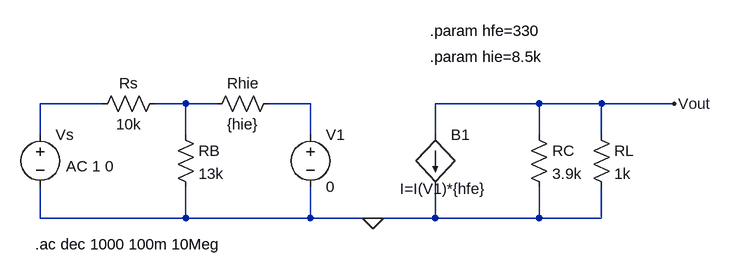
[diagram p0: schematic Tp modelos hibridos en DASE.asc]
Tp modelos hibridos en DASE.asc, the LTspice schematic file:
Version 4
SHEET 1 880 680
WIRE -144 80 -240 80
WIRE -16 80 -64 80
WIRE 32 80 -16 80
WIRE 176 80 112 80
WIRE 528 80 368 80
WIRE 624 80 528 80
WIRE 736 80 624 80
WIRE -240 128 -240 80
WIRE -16 128 -16 80
WIRE 176 128 176 80
WIRE 368 128 368 80
WIRE 528 128 528 80
WIRE 624 128 624 80
WIRE -240 256 -240 208
WIRE -16 256 -16 208
WIRE -16 256 -240 256
WIRE 176 256 176 208
WIRE 176 256 -16 256
WIRE 272 256 176 256
WIRE 368 256 368 208
WIRE 368 256 272 256
WIRE 528 256 528 208
WIRE 528 256 368 256
WIRE 624 256 624 208
WIRE 624 256 528 256
FLAG 736 80 Vout
FLAG 272 256 0
SYMBOL voltage -240 112 R0
WINDOW 123 40 64 Left 2
WINDOW 39 0 0 Left 0
SYMATTR Value2 AC 1 0
SYMATTR InstName Vs
SYMATTR Value ""
SYMBOL voltage 176 112 R0
SYMATTR InstName V1
SYMATTR Value 0
SYMBOL res -32 112 R0
SYMATTR InstName RB
SYMATTR Value 13k
SYMBOL res 128 64 R90
WINDOW 0 0 56 VBottom 2
WINDOW 3 32 56 VTop 2
SYMATTR InstName Rhie
SYMATTR Value {hie}
SYMBOL res -48 64 R90
WINDOW 0 0 56 VBottom 2
WINDOW 3 32 56 VTop 2
SYMATTR InstName Rs
SYMATTR Value 10k
SYMBOL res 608 112 R0
SYMATTR InstName RL
SYMATTR Value 1k
SYMBOL res 512 112 R0
SYMATTR InstName RC
SYMATTR Value 3.9k
SYMBOL bi 368 128 R0
WINDOW 3 -54 83 Left 2
SYMATTR InstName B1
SYMATTR Value I=I(V1)*{hfe}
TEXT 360 -32 Left 2 !.param hfe=330
TEXT 360 8 Left 2 !.param hie=8.5k
TEXT -248 296 Left 2 !.ac dec 1000 100m 10Meg

The netlist it stands for:
* Tp modelos hibridos en DASE.asc
Vs N001 0 AC 1 0
V1 N003 0 0
RB N002 0 13k
Rhie N003 N002 {hie}
Rs N002 N001 10k
RL Vout 0 1k
RC Vout 0 3.9k
B1 Vout 0 I=I(V1)*{hfe}
.param hfe=330
.param hie=8.5k
.ac dec 1000 100m 10Meg
.backanno
.end